# Altium schematic sheet Sheet1.SchDoc
size A4
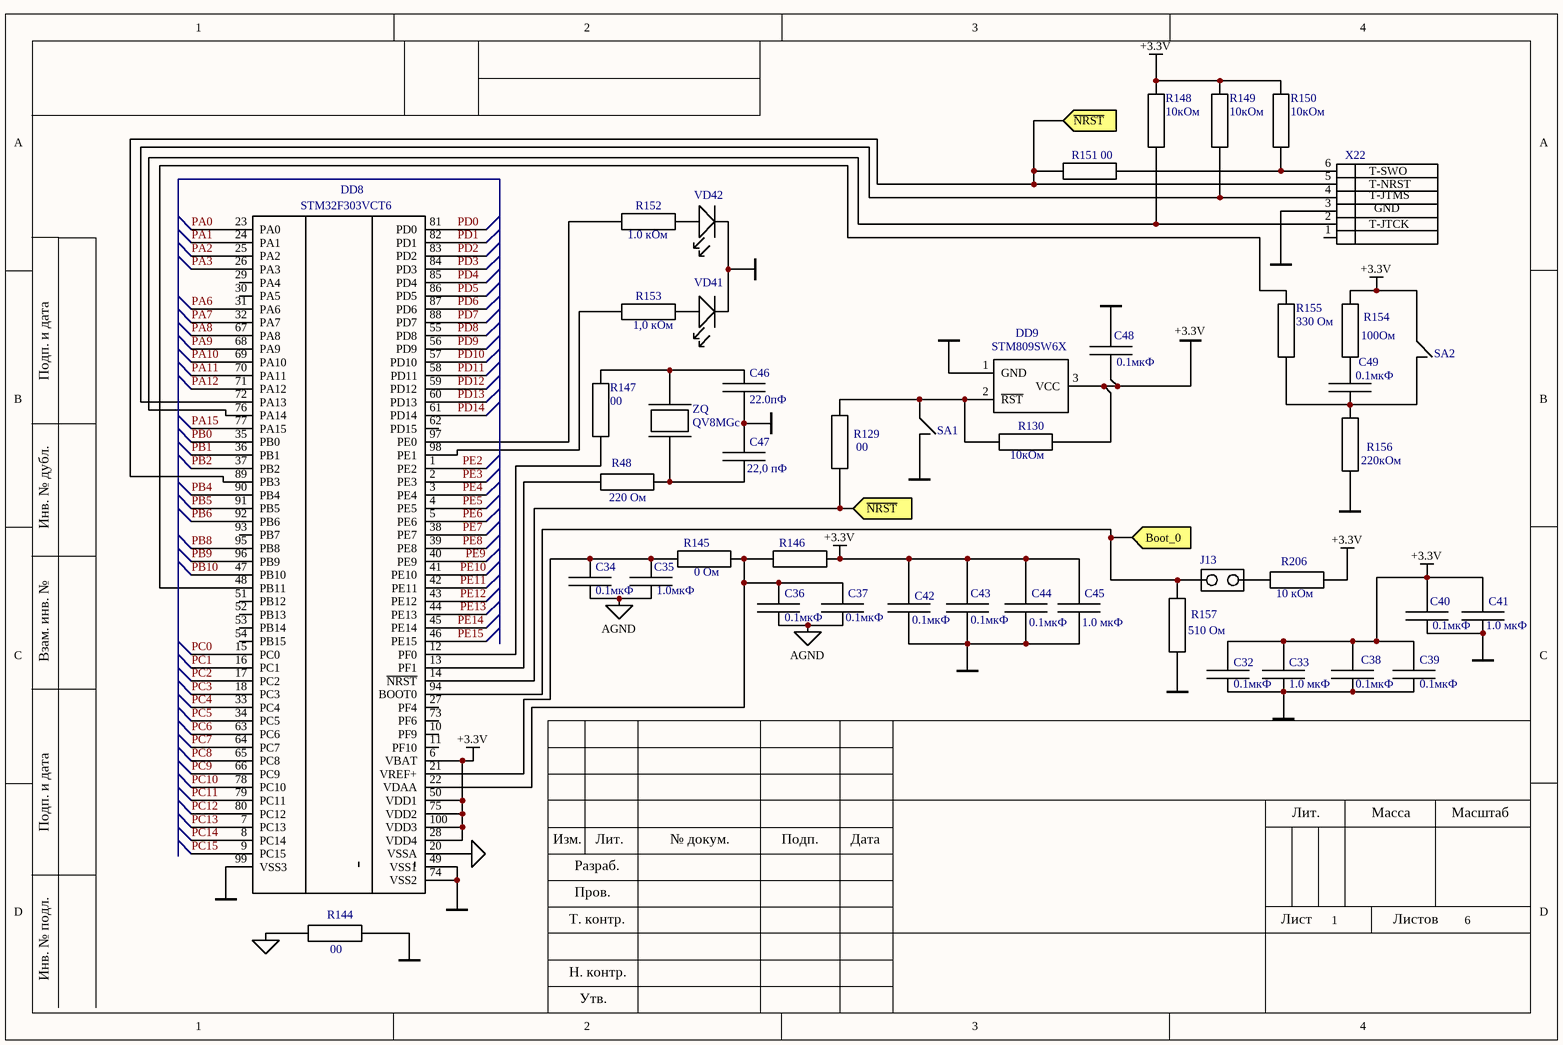
[diagram p0: Sheet1.SchDoc]

## Parts
C32  C0805  (value not drawn)
C33  C0805  (value not drawn)
C34  C0805  (value not drawn)
C35  C0805  (value not drawn)
C36  C0805  (value not drawn)
C37  C0805  (value not drawn)
C38  C0805  (value not drawn)
C39  C0805  (value not drawn)
C40  C0805  (value not drawn)
C41  C0805  (value not drawn)
C42  C0805  (value not drawn)
C43  C0805  (value not drawn)
C44  C0805  (value not drawn)
C45  C0805  (value not drawn)
C46  C0805  (value not drawn)
C47  C0805  (value not drawn)
C48  C0805  (value not drawn)
C49  C0805  (value not drawn)
DD8  STM32F303VCT6
DD9  STM809SW6X
J13  jamp  (value not drawn)
R48  R0805  (value not drawn)
R129  R0805  (value not drawn)
R130  R0805  (value not drawn)
R144  R0805  (value not drawn)
R145  R0805  (value not drawn)
R146  R0805  (value not drawn)
R147  R0805  (value not drawn)
R148  R0805  (value not drawn)
R149  R0805  (value not drawn)
R150  R0805  (value not drawn)
R151  R0805  (value not drawn)
R152  R0805  (value not drawn)
R153  R0805  (value not drawn)
R154  R0805  (value not drawn)
R155  R0805  (value not drawn)
R156  R0805  (value not drawn)
R157  R0805  (value not drawn)
R206  R0805  (value not drawn)
SA1  SWT-1  (value not drawn)
SA2  SWT-1  (value not drawn)
VD41  LED  (value not drawn)
VD42  LED  (value not drawn)
X22  PLS-6  (value not drawn)
ZQ  QV8MGc

## Ports
Boot_0, ~{NRST}

## Nets
+3.3V: C32.1 C33.1 C38.1 C39.1 C40.1 C41.1 C42.1 C43.1 C44.1 C45.1 C48.2 DD8.6(VBAT) DD8.28(VDD4) DD8.50(VDD1) DD8.75(VDD2) DD8.100(VDD3) DD9.3(VCC) R130.2 R146.2 R148.2 R149.2 R150.2 R154.2 R206.2 SA2.1
AGND: C34.2 C35.2 C36.2 C37.2 DD8.20(VSSA) R144.1
GND: C32.2 C33.2 C38.2 C39.2 C40.2 C41.2 C42.2 C43.2 C44.2 C45.2 C46.1 C47.2 C48.1 DD8.49(VSS1) DD8.74(VSS2) DD8.99(VSS3) DD9.1(GND) R144.2 R156.1 R157.1 SA1.2 VD41.1(A) VD42.1(A) X22.3
~{NRST}: DD8.14(~{NRST}) DD8.89(PB3) R129.1 R151.1 X22.5 ; port ~{NRST}
Boot_0: DD8.94(BOOT0) J13.1 R157.2 ; port Boot_0
PA0: DD8.23(PA0)
PA1: DD8.24(PA1)
PA2: DD8.25(PA2)
PA3: DD8.26(PA3)
PA6: DD8.31(PA6)
PA7: DD8.32(PA7)
PA8: DD8.67(PA8)
PA9: DD8.68(PA9)
PA10: DD8.69(PA10)
PA11: DD8.70(PA11)
PA12: DD8.71(PA12)
PA15: DD8.77(PA15)
PB0: DD8.35(PB0)
PB1: DD8.36(PB1)
PB2: DD8.37(PB2)
PB4: DD8.90(PB4)
PB5: DD8.91(PB5)
PB6: DD8.92(PB6)
PB8: DD8.95(PB8)
PB9: DD8.96(PB9)
PB10: DD8.47(PB10)
PC0: DD8.15(PC0)
PC1: DD8.16(PC1)
PC2: DD8.17(PC2)
PC3: DD8.18(PC3)
PC4: DD8.33(PC4)
PC5: DD8.34(PC5)
PC6: DD8.63(PC6)
PC7: DD8.64(PC7)
PC8: DD8.65(PC8)
PC9: DD8.66(PC9)
PC10: DD8.78(PC10)
PC11: DD8.79(PC11)
PC12: DD8.80(PC12)
PC13: DD8.7(PC13)
PC14: DD8.8(PC14)
PC15: DD8.9(PC15)
PD0: DD8.81(PD0)
PD1: DD8.82(PD1)
PD2: DD8.83(PD2)
PD3: DD8.84(PD3)
PD4: DD8.85(PD4)
PD5: DD8.86(PD5)
PD6: DD8.87(PD6)
PD7: DD8.88(PD7)
PD8: DD8.55(PD8)
PD9: DD8.56(PD9)
PD10: DD8.57(PD10)
PD11: DD8.58(PD11)
PD12: DD8.59(PD12)
PD13: DD8.60(PD13)
PD14: DD8.61(PD14)
PE2: DD8.1(PE2)
PE3: DD8.2(PE3)
PE4: DD8.3(PE4)
PE5: DD8.4(PE5)
PE6: DD8.5(PE6)
PE7: DD8.38(PE7)
PE8: DD8.39(PE8)
PE9: DD8.40(PE9)
PE10: DD8.41(PE10)
PE11: DD8.42(PE11)
PE12: DD8.43(PE12)
PE13: DD8.44(PE13)
PE14: DD8.45(PE14)
PE15: DD8.46(PE15)
NetC34_1: C34.1 C35.1 DD8.21(VREF+) R145.1
NetC36_1: C36.1 C37.1 DD8.22(VDAA) R145.2 R146.1
NetC46_2: C46.2 R147.2 ZQ.2
NetC47_1: C47.1 R48.2 ZQ.1
NetC49_1: C49.1 R155.1 R156.2 SA2.2
NetC49_2: C49.2 R154.1
NetDD8_12: DD8.12(PF0) R147.1
NetDD8_13: DD8.13(PF1) R48.1
NetDD8_48: DD8.48(PB11) R155.2
NetDD8_72: DD8.72(PA13) R149.1 X22.4
NetDD8_76: DD8.76(PA14) R148.1 X22.2
NetDD8_97: DD8.97(PE0) R152.1
NetDD8_98: DD8.98(PE1) R153.1
NetDD9_2: DD9.2(~{RST}) R129.2 R130.1 SA1.1
NetJ13_2: J13.2 R206.1
NetR150_1: R150.1 R151.2 X22.6

Not connected (* = marked no-connect by the designer): DD8 10(PF9) 11(PF10) 27(PF4) 29(PA4) 30(PA5) 51(PB12) 52(PB13) 53(PB14) 54(PB15) 62(PD15) 73(PF6) 93(PB7); R152 2; R153 2; VD41 2(K); VD42 2(K); X22 1

## Notes on the sheet
- (near X22) T-NRST
- (near X22) T-SWO
- (near X22) T-JTCK
- (near X22) T-JTMS
- (near X22) GND
- 1
- 6
- Подп. и дата
- Инв. № дубл.
- Взам. инв. №
- Изм.
- Лит.
- № докум.
- Подп.
- Дата
- Масса
- Масштаб
- Т. контр.
- Разраб.
- Пров.
- Лист
- Листов
- Инв. № подл.
- Н. контр.
- Утв.
- (in symbol C0805) 0.1мкФ; 1.0 мкФ; 1.0мкФ; 22.0пФ; 22,0 пФ
- (in symbol R0805) 0 Ом; 00; 220 Ом; 10 кОм; 510 Ом; 330 Ом; 1.0 кОм; 1,0 кОм; 100Ом; 220кОм; 10кОм